# Altium schematic sheet MCU.SchDoc
size A4; SheetNumber: 4; SheetTotal: 5
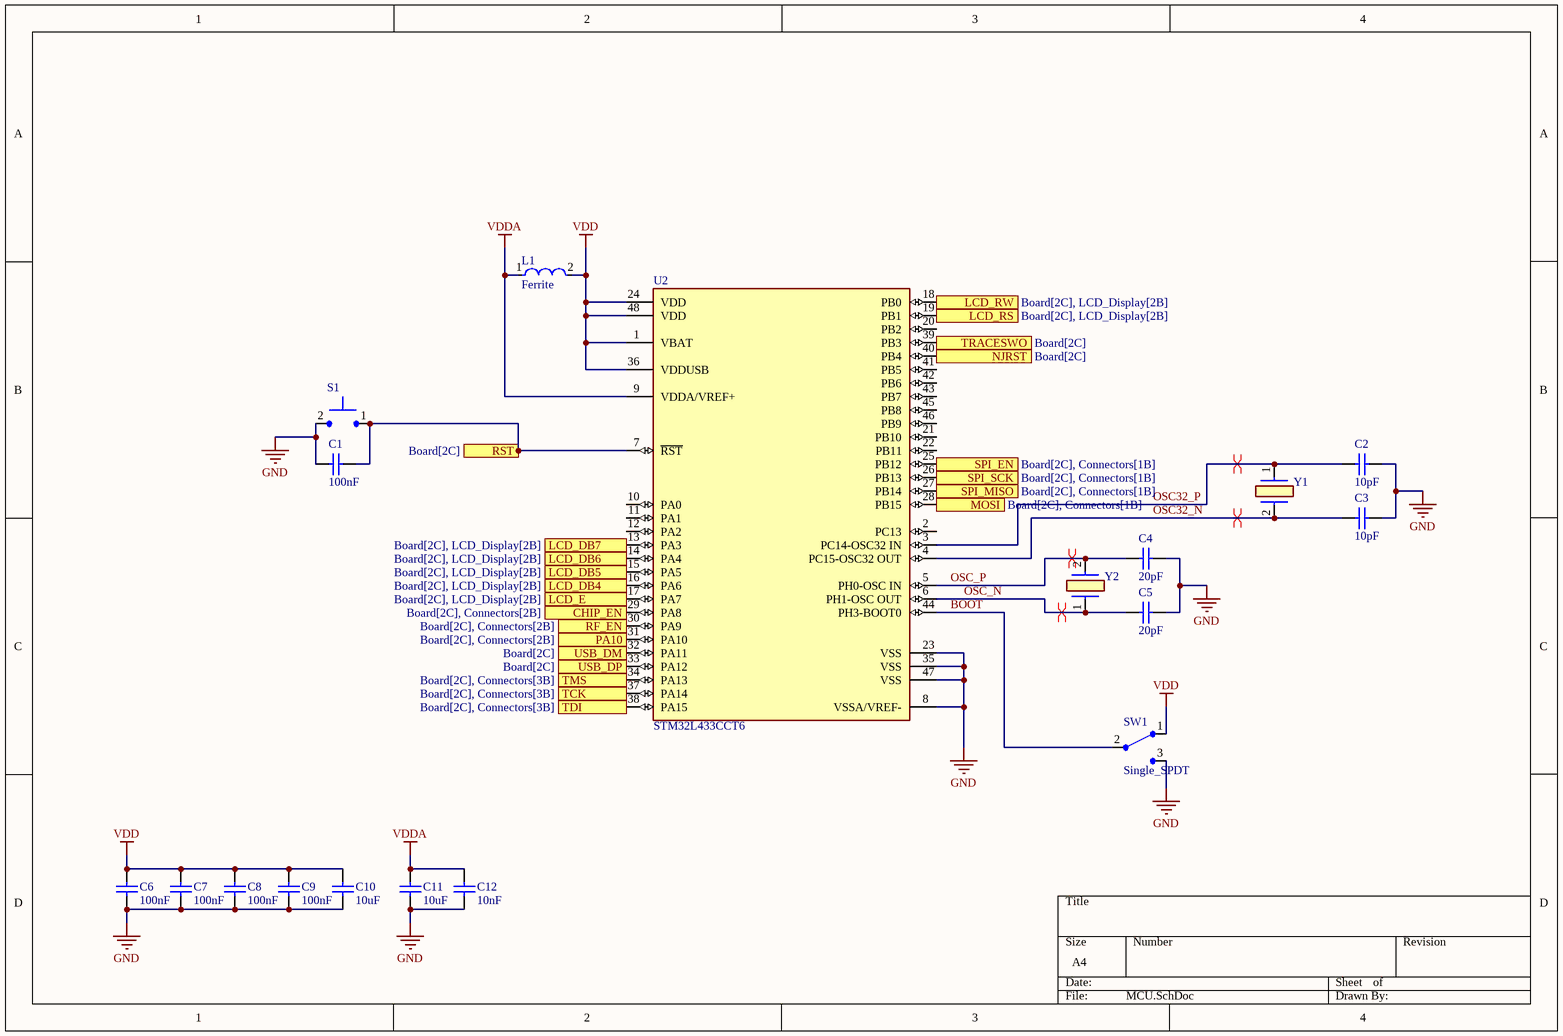
[diagram p0: MCU.SchDoc]

## Parts
C1  100nF  [CAP_0402]
C2  10pF  [CAP_0402]
C3  10pF  [CAP_0402]
C4  20pF  [CAP_0402]
C5  20pF  [CAP_0402]
C6  100nF  [CAP_0402]
C7  100nF  [CAP_0402]
C8  100nF  [CAP_0402]
C9  100nF  [CAP_0402]
C10  10uF  [CAP_0402]
C11  10uF  [CAP_0402]
C12  10nF  [CAP_0402]
L1  Ferrite  [FP-LQW18AN_00-MFG]
S1  Generic 2-pin push button  (value not drawn)
SW1  Single_SPDT
U2  STM32L433CCT6  [FP-LQFP48-5B-MFG]
Y1  ECS-.320-12.5-13X  [ECS32012513X]  (value not drawn)
Y2  NX3225GD-8MHZ-STD-CRA-3  [NX3225GD8MHZSTDCRA3]  (value not drawn)

## Ports
CHIP_EN (in, see Board[2C], Connectors[2B]), LCD_DB4 (in, see Board[2C], LCD_Display[2B]), LCD_DB5 (in, see Board[2C], LCD_Display[2B]), LCD_DB6 (in, see Board[2C], LCD_Display[2B]), LCD_DB7 (in, see Board[2C], LCD_Display[2B]), LCD_E (in, see Board[2C], LCD_Display[2B]), LCD_RS (in, see Board[2C], LCD_Display[2B]), LCD_RW (in, see Board[2C], LCD_Display[2B]), MOSI (in, see Board[2C], Connectors[1B]), NJRST (in, see Board[2C]), PA10 (in, see Board[2C], Connectors[2B]), RF_EN (in, see Board[2C], Connectors[2B]), RST (in, see Board[2C]), SPI_EN (in, see Board[2C], Connectors[1B]), SPI_MISO (in, see Board[2C], Connectors[1B]), SPI_SCK (in, see Board[2C], Connectors[1B]), TCK (in, see Board[2C], Connectors[3B]), TDI (in, see Board[2C], Connectors[3B]), TMS (in, see Board[2C], Connectors[3B]), TRACESWO (in, see Board[2C]), USB_DM (in, see Board[2C]), USB_DP (in, see Board[2C])

## Nets
GND: C1.1 C2.2 C3.2 C4.2 C5.2 C6.1 C7.1 C8.1 C9.1 C10.1 C11.1 C12.1 S1.2 SW1.3 U2.8(VSSA/VREF-) U2.23(VSS) U2.35(VSS) U2.47(VSS)
VDD: C6.2 C7.2 C8.2 C9.2 C10.2 L1.2 SW1.1 U2.1(VBAT) U2.24(VDD) U2.36(VDDUSB) U2.48(VDD)
VDDA: C11.2 C12.2 L1.1 U2.9(VDDA/VREF+)
BOOT: SW1.2 U2.44(PH3-BOOT0)
CHIP_EN: U2.29(PA8) ; port CHIP_EN
LCD_DB4: U2.16(PA6) ; port LCD_DB4
LCD_DB5: U2.15(PA5) ; port LCD_DB5
LCD_DB6: U2.14(PA4) ; port LCD_DB6
LCD_DB7: U2.13(PA3) ; port LCD_DB7
LCD_E: U2.17(PA7) ; port LCD_E
LCD_RS: U2.19(PB1) ; port LCD_RS
LCD_RW: U2.18(PB0) ; port LCD_RW
MOSI: U2.28(PB15) ; port MOSI
NJRST: U2.40(PB4) ; port NJRST
OSC32_N: C3.1 U2.4(PC15-OSC32_OUT) Y1.2(CRYSTAL_2)
OSC32_P: C2.1 U2.3(PC14-OSC32_IN) Y1.1
OSC_N: C5.1 U2.6(PH1-OSC_OUT) Y2.1
OSC_P: C4.1 U2.5(PH0-OSC_IN) Y2.2
PA10: U2.31(PA10) ; port PA10
RF_EN: U2.30(PA9) ; port RF_EN
RST: C1.2 S1.1 U2.7(~{RST}) ; port RST
SPI_EN: U2.25(PB12) ; port SPI_EN
SPI_MISO: U2.27(PB14) ; port SPI_MISO
SPI_SCK: U2.26(PB13) ; port SPI_SCK
TCK: U2.37(PA14) ; port TCK
TDI: U2.38(PA15) ; port TDI
TMS: U2.34(PA13) ; port TMS
TRACESWO: U2.39(PB3) ; port TRACESWO
USB_DM: U2.32(PA11) ; port USB_DM
USB_DP: U2.33(PA12) ; port USB_DP

Not connected (* = marked no-connect by the designer): U2 2(PC13) 10(PA0) 11(PA1) 12(PA2) 20(PB2) 21(PB10) 22(PB11) 41(PB5) 42(PB6) 43(PB7) 45(PB8) 46(PB9)

## Layout directives
differential pair: OSC32_N, OSC32_P, OSC_N, OSC_P

## Library data of the parts
C1-C12 = Capacitor: Manufacturer: Murata; Part Number: GRM155R71E103KA01D
L1 = Ferrite_bead: Test Frequency: 100MHz; DC Current: 500mA; Current: 400mA; Series Resistance: 170mR; Tolerance: 2%; Core Material: Non-Magnetic; Shielding: Unshielded; Self Resonant Frequency: 4.6GHz; Inductance: 22nH; Q Factor: 40; Weight: 0.000106oz; Military Standard: Not; Case/Package: 0603; Case Code (Metric): 1608; Width: 0.8mm; Length: 1.6mm; Depth: 1mm; REACH SVHC: No SVHC; Case Code (Imperial): 0603; Lead Free: Lead Free; Mount: Surface Mount; Resistor Type: Wirewound; Inductance Tolerance: 2%; Number of Pins: 2; Termination: SMD/SMT; Package Quantity: 4000; Height - Seated (Max): 0.039inch; Height: 0.8mm; Packaging: Tape and Reel; Max DC Current: 500mA; Current Rating: 500mA; Min Operating Temperature: -55°C; DC Resistance (DCR): 170mR; Max Operating Temperature: 125°C
S1 = Push_btn_2pin
U2 = STM32L433CCT6: IC MCU 32BIT 256KB FLASH 48LQFP; Manufacturer: STMicroelectronics; Max Junction Temp: +105°C; Min Supply Voltage: 1.55V; Number Of Uart Channels: 4; Number Of I2C Channels: 3; Max Supply Voltage: 3.6V; Number Of I/Os: 38; Number Of Usb Channels: 1; Memory Size: 256KBytes; Interface: I2C,SPI,UART,USART,CAN,USB,LIN,IrDA,SMBus,Other; Ram Size: 64KBytes; Standoff Height: 0.05mm; Number Of Pwm Channels: 14; Number Of Timers/Counters: 9; Frequency: 80MHz; Data Bus Width: 32bits; Number Of Adc Channels: 10; Core Architecture: Arm Cortex-M4; Digikey Description: IC MCU 32BIT 256KB FLASH 48LQFP; Category: IC; Ambient Temperature Range High: +85°C; Number Of Spi Channels: 3; Temperature Range High: +85°C; ComponentLink2Description: Datasheet; Device Class L3: Microcontrollers; Device Class L2: Embedded Processors and Controllers; Temperature Range Low: -40°C; Ambient Temperature Range Low: -40°C; Manufacturer Part Number: STM32L433CCT6; Automotive: No; Package: LQFP48-5B; Ipc Land Pattern Name: QFP50P900X900X160-48; RoHS: TRUE; Octopart: https://octopart.com/stm32l433cct6-stmicroelectronics-71093511; Number Of A/D Converters: 1; Memory Type: FLASH; Lead Free: Yes; ComponentLink2URL: https://www.st.com/resource/en/datasheet/stm32l433cc.pdf; Device Class L1: Integrated Circuits (ICs); Temperature: -40°C to +85°C; Number Of Cores: 1; Height: 1.6mm
Y1 = ECS-.320-12.5-13X: Crystal or Oscillator; Manufacturer_Name: ECS; Datasheet Link: https://g.componentsearchengine.com/Datasheets/1/ECS-.320-12.5-13X.pdf; Height: 6.2mm; Manufacturer_Part_Number: ECS-.320-12.5-13X; Mouser Part Number: 520-ECS-32-12.5-13X; Mouser Price/Stock: https://www.mouser.co.uk/ProductDetail/ECS/ECS-.320-12.5-13X?qs=aGohqJksTCKD9WVp6G%2FEsQ%3D%3D; Arrow Part Number: ECS-.320-12.5-13X; Arrow Price/Stock: https://www.arrow.com/en/products/ecs-.320-12.5-13x/ecs-international?region=nac
Y2 = NX3225GD-8MHZ-STD-CRA-3: Crystal or Oscillator; Manufacturer_Name: NDK; Datasheet Link: https://th.mouser.com/datasheet/2/905/c_NX3225GD-STD-CRA-3_e-1317534.pdf; Height: 1mm; Manufacturer_Part_Number: NX3225GD-8MHZ-STD-CRA-3; Mouser Part Number: 344-NX3225GD8MCRA3; Mouser Price/Stock: https://www.mouser.co.uk/ProductDetail/NDK/NX3225GD-8MHZ-STD-CRA-3?qs=55YtniHzbhDA0fw3anYH2g%3D%3D